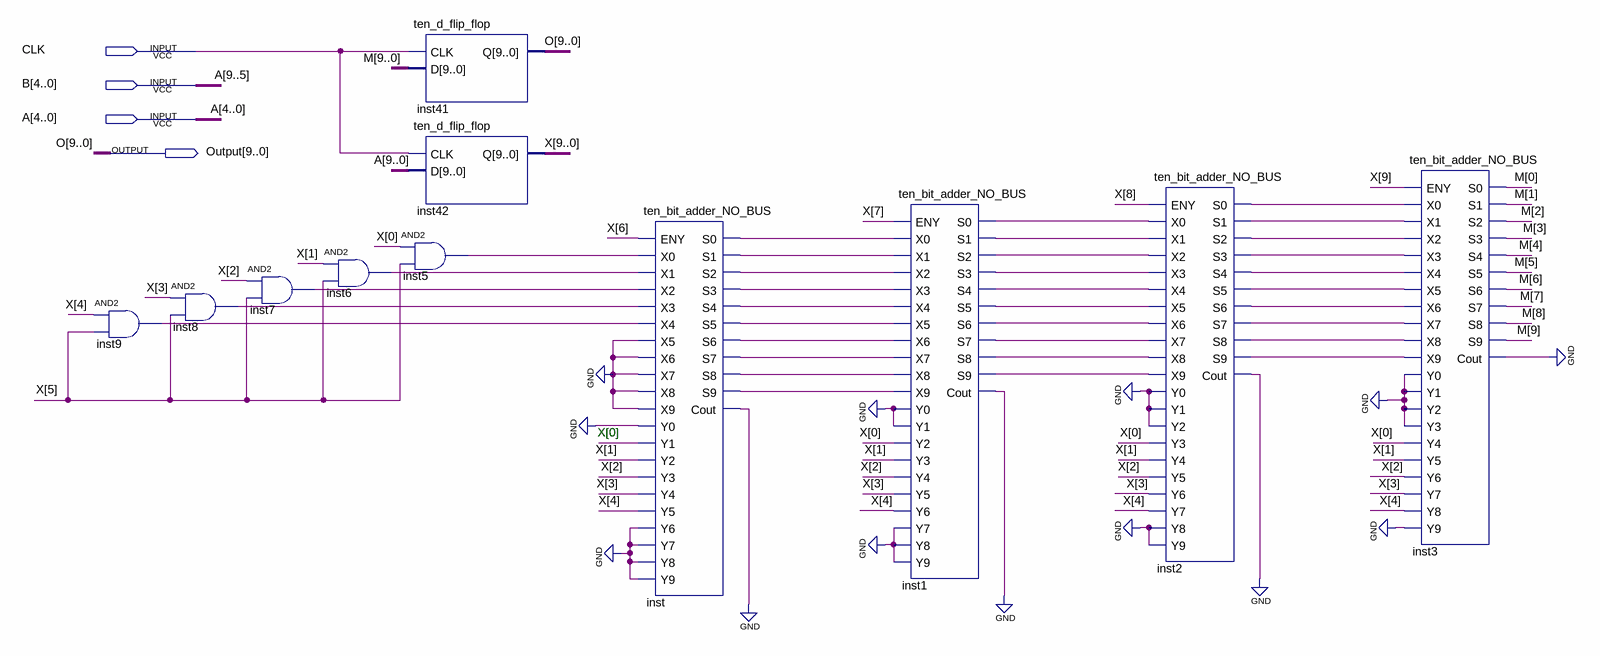
[diagram p0: schematic sheet]
// Quartus schematic pipelined_multiply.bdf as structural Verilog: 11 symbols, 4 pins
module pipelined_multiply (
  input  CLK,
  input  [4:0] B,
  input  [4:0] A,
  output [9:0] Output
);

  wire inst1_cout, inst1_s0, inst1_s1, inst1_s2, inst1_s3, inst1_s4, inst1_s5, inst1_s6, inst1_s7, inst1_s8,
       inst1_s9, inst2_cout, inst2_s0, inst2_s1, inst2_s2, inst2_s3, inst2_s4, inst2_s5, inst2_s6, inst2_s7,
       inst2_s8, inst2_s9, inst3_cout, inst5_out, inst6_out, inst7_out, inst8_out, inst9_out, inst_cout,
       inst_s0, inst_s1, inst_s2, inst_s3, inst_s4, inst_s5, inst_s6, inst_s7, inst_s8, inst_s9;
  wire [9:0] M, X;

  and inst9 (inst9_out, X[4], X[5]);
  and inst8 (inst8_out, X[3], X[5]);
  and inst7 (inst7_out, X[2], X[5]);
  and inst6 (inst6_out, X[1], X[5]);
  ten_d_flip_flop inst41 (.CLK(CLK), .D(M), .Q(Output));
  ten_d_flip_flop inst42 (.CLK(CLK), .D({B, A}), .Q(X));
  and inst5 (inst5_out, X[0], X[5]);
  ten_bit_adder_NO_BUS inst (
    .ENY(X[6]), .X0(inst5_out), .X1(inst6_out), .X2(inst7_out), .X3(inst8_out), .X4(inst9_out), .X5(1'b0),
    .X6(1'b0), .X7(1'b0), .X8(1'b0), .X9(1'b0), .Y0(1'b0), .Y1(X[0]), .Y2(X[1]), .Y3(X[2]), .Y4(X[3]),
    .Y5(X[4]), .Y6(1'b0), .Y7(1'b0), .Y8(1'b0), .Y9(1'b0), .S0(inst_s0), .S1(inst_s1), .S2(inst_s2),
    .S3(inst_s3), .S4(inst_s4), .S5(inst_s5), .S6(inst_s6), .S7(inst_s7), .S8(inst_s8), .S9(inst_s9),
    .Cout(inst_cout));
  ten_bit_adder_NO_BUS inst1 (
    .ENY(X[7]), .X0(inst_s0), .X1(inst_s1), .X2(inst_s2), .X3(inst_s3), .X4(inst_s4), .X5(inst_s5),
    .X6(inst_s6), .X7(inst_s7), .X8(inst_s8), .X9(inst_s9), .Y0(1'b0), .Y1(1'b0), .Y2(X[0]), .Y3(X[1]),
    .Y4(X[2]), .Y5(X[3]), .Y6(X[4]), .Y7(1'b0), .Y8(1'b0), .Y9(1'b0), .S0(inst1_s0), .S1(inst1_s1),
    .S2(inst1_s2), .S3(inst1_s3), .S4(inst1_s4), .S5(inst1_s5), .S6(inst1_s6), .S7(inst1_s7), .S8(inst1_s8),
    .S9(inst1_s9), .Cout(inst1_cout));
  ten_bit_adder_NO_BUS inst2 (
    .ENY(X[8]), .X0(inst1_s0), .X1(inst1_s1), .X2(inst1_s2), .X3(inst1_s3), .X4(inst1_s4), .X5(inst1_s5),
    .X6(inst1_s6), .X7(inst1_s7), .X8(inst1_s8), .X9(inst1_s9), .Y0(1'b0), .Y1(1'b0), .Y2(1'b0), .Y3(X[0]),
    .Y4(X[1]), .Y5(X[2]), .Y6(X[3]), .Y7(X[4]), .Y8(1'b0), .Y9(1'b0), .S0(inst2_s0), .S1(inst2_s1),
    .S2(inst2_s2), .S3(inst2_s3), .S4(inst2_s4), .S5(inst2_s5), .S6(inst2_s6), .S7(inst2_s7), .S8(inst2_s8),
    .S9(inst2_s9), .Cout(inst2_cout));
  ten_bit_adder_NO_BUS inst3 (
    .ENY(X[9]), .X0(inst2_s0), .X1(inst2_s1), .X2(inst2_s2), .X3(inst2_s3), .X4(inst2_s4), .X5(inst2_s5),
    .X6(inst2_s6), .X7(inst2_s7), .X8(inst2_s8), .X9(inst2_s9), .Y0(1'b0), .Y1(1'b0), .Y2(1'b0), .Y3(1'b0),
    .Y4(X[0]), .Y5(X[1]), .Y6(X[2]), .Y7(X[3]), .Y8(X[4]), .Y9(1'b0), .S0(M[0]), .S1(M[1]), .S2(M[2]),
    .S3(M[3]), .S4(M[4]), .S5(M[5]), .S6(M[6]), .S7(M[7]), .S8(M[8]), .S9(M[9]), .Cout(inst3_cout));
  // also tied to GND on the sheet: {inst3_cout, inst1_cout, inst_cout, inst2_cout}

  // Other names for the same wires on the sheet: A[9:5] = B; O[9:0] = Output

  // Notes on the sheet:
  //   X[0]
  //   X[0]
endmodule
